# Altium project sla2216.PrjPcb
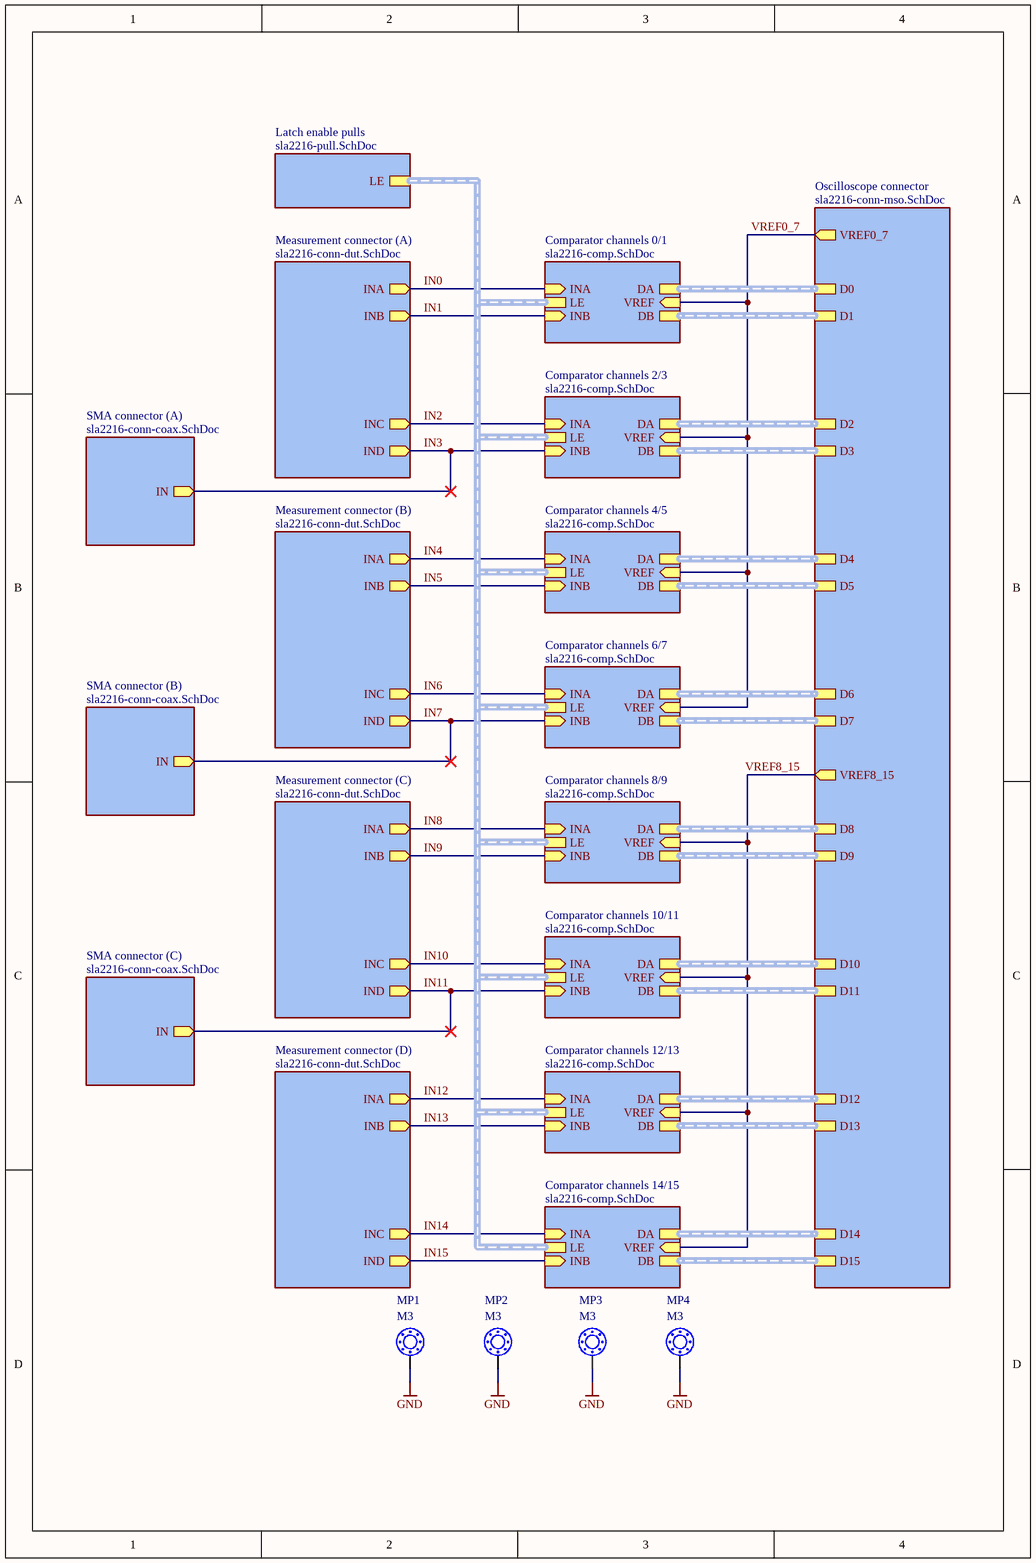
[diagram p0: sla2216.SchDoc]
6 sheets, 249 parts. Net scope: hierarchical (ports join the sheet entries above them; power ports are global).
Board file: sla2216.PcbDoc
Sheets:
  sla2216.SchDoc
    Oscilloscope connector = sla2216-conn-mso.SchDoc
    Comparator channels 0/1 = sla2216-comp.SchDoc
    Comparator channels 2/3 = sla2216-comp.SchDoc
    Comparator channels 4/5 = sla2216-comp.SchDoc
    Comparator channels 6/7 = sla2216-comp.SchDoc
    Comparator channels 8/9 = sla2216-comp.SchDoc
    Comparator channels 10/11 = sla2216-comp.SchDoc
    Comparator channels 12/13 = sla2216-comp.SchDoc
    Comparator channels 14/15 = sla2216-comp.SchDoc
    Measurement connector (A) = sla2216-conn-dut.SchDoc
    Measurement connector (B) = sla2216-conn-dut.SchDoc
    Measurement connector (C) = sla2216-conn-dut.SchDoc
    Measurement connector (D) = sla2216-conn-dut.SchDoc
    Latch enable pulls = sla2216-pull.SchDoc
    SMA connector (A) = sla2216-conn-coax.SchDoc
    SMA connector (B) = sla2216-conn-coax.SchDoc
    SMA connector (C) = sla2216-conn-coax.SchDoc

## Sheet sla2216.SchDoc
size A4 portrait; DocumentNumber: 1; SheetNumber: 1; SheetTotal: 6

### Parts
MP1  M3  [MP M3]  (no BOM)
MP2  M3  [MP M3]  (no BOM)
MP3  M3  [MP M3]  (no BOM)
MP4  M3  [MP M3]  (no BOM)

### Sub-sheets
Comparator channels 0/1 = sla2216-comp.SchDoc: DB (harness RSPECL), DA (harness RSPECL), INA (in), INB (in), VREF (in), LE (harness RSPECL)
Comparator channels 2/3 = sla2216-comp.SchDoc: DB (harness RSPECL), DA (harness RSPECL), INA (in), INB (in), VREF (in), LE (harness RSPECL)
Comparator channels 4/5 = sla2216-comp.SchDoc: DB (harness RSPECL), DA (harness RSPECL), INA (in), INB (in), VREF (in), LE (harness RSPECL)
Comparator channels 6/7 = sla2216-comp.SchDoc: DB (harness RSPECL), DA (harness RSPECL), INA (in), INB (in), VREF (in), LE (harness RSPECL)
Comparator channels 8/9 = sla2216-comp.SchDoc: DB (harness RSPECL), DA (harness RSPECL), INA (in), INB (in), VREF (in), LE (harness RSPECL)
Comparator channels 10/11 = sla2216-comp.SchDoc: DB (harness RSPECL), DA (harness RSPECL), INA (in), INB (in), VREF (in), LE (harness RSPECL)
Comparator channels 12/13 = sla2216-comp.SchDoc: DB (harness RSPECL), DA (harness RSPECL), INA (in), INB (in), VREF (in), LE (harness RSPECL)
Comparator channels 14/15 = sla2216-comp.SchDoc: DB (harness RSPECL), DA (harness RSPECL), INA (in), INB (in), VREF (in), LE (harness RSPECL)
Latch enable pulls = sla2216-pull.SchDoc: LE (harness RSPECL)
Measurement connector (A) = sla2216-conn-dut.SchDoc: INA (out), INB (out), INC (out), IND (out)
Measurement connector (B) = sla2216-conn-dut.SchDoc: INA (out), INB (out), INC (out), IND (out)
Measurement connector (C) = sla2216-conn-dut.SchDoc: INA (out), INB (out), INC (out), IND (out)
Measurement connector (D) = sla2216-conn-dut.SchDoc: INA (out), INB (out), INC (out), IND (out)
Oscilloscope connector = sla2216-conn-mso.SchDoc: D0 (harness RSPECL), D1 (harness RSPECL), D2 (harness RSPECL), D3 (harness RSPECL), VREF0_7 (out), D5 (harness RSPECL), D4 (harness RSPECL), D7 (harness RSPECL), D6 (harness RSPECL), VREF8_15 (out), D8 (harness RSPECL), D9 (harness RSPECL), D11 (harness RSPECL), D10 (harness RSPECL), D12 (harness RSPECL), D13 (harness RSPECL), D14 (harness RSPECL), D15 (harness RSPECL)
SMA connector (A) = sla2216-conn-coax.SchDoc: IN (out)
SMA connector (B) = sla2216-conn-coax.SchDoc: IN (out)
SMA connector (C) = sla2216-conn-coax.SchDoc: IN (out)

### Nets
GND: MP1.MP MP2.MP MP3.MP MP4.MP
IN0: sheet Comparator channels 0/1/INA, sheet Measurement connector (A)/INA
IN1: sheet Comparator channels 0/1/INB, sheet Measurement connector (A)/INB
IN2: sheet Comparator channels 2/3/INA, sheet Measurement connector (A)/INC
IN3: sheet Comparator channels 2/3/INB, sheet Measurement connector (A)/IND, sheet SMA connector (A)/IN
IN4: sheet Comparator channels 4/5/INA, sheet Measurement connector (B)/INA
IN5: sheet Comparator channels 4/5/INB, sheet Measurement connector (B)/INB
IN6: sheet Comparator channels 6/7/INA, sheet Measurement connector (B)/INC
IN7: sheet Comparator channels 6/7/INB, sheet Measurement connector (B)/IND, sheet SMA connector (B)/IN
IN8: sheet Comparator channels 8/9/INA, sheet Measurement connector (C)/INA
IN9: sheet Comparator channels 8/9/INB, sheet Measurement connector (C)/INB
IN10: sheet Comparator channels 10/11/INA, sheet Measurement connector (C)/INC
IN11: sheet Comparator channels 10/11/INB, sheet Measurement connector (C)/IND, sheet SMA connector (C)/IN
IN12: sheet Comparator channels 12/13/INA, sheet Measurement connector (D)/INA
IN13: sheet Comparator channels 12/13/INB, sheet Measurement connector (D)/INB
IN14: sheet Comparator channels 14/15/INA, sheet Measurement connector (D)/INC
IN15: sheet Comparator channels 14/15/INB, sheet Measurement connector (D)/IND
VREF0_7: sheet Oscilloscope connector/VREF0_7, sheet Comparator channels 0/1/VREF, sheet Comparator channels 2/3/VREF, sheet Comparator channels 4/5/VREF, sheet Comparator channels 6/7/VREF
VREF8_15: sheet Oscilloscope connector/VREF8_15, sheet Comparator channels 8/9/VREF, sheet Comparator channels 10/11/VREF, sheet Comparator channels 12/13/VREF, sheet Comparator channels 14/15/VREF

### Buses and harness runs
harness sheet Comparator channels 0/1/DA = sheet Oscilloscope connector/D0
harness sheet Comparator channels 0/1/DB = sheet Oscilloscope connector/D1
harness sheet Comparator channels 0/1/LE = sheet Comparator channels 2/3/LE = sheet Comparator channels 4/5/LE = sheet Comparator channels 6/7/LE = sheet Comparator channels 8/9/LE = sheet Comparator channels 10/11/LE = sheet Comparator channels 12/13/LE = sheet Comparator channels 14/15/LE = sheet Latch enable pulls/LE
harness sheet Comparator channels 2/3/DA = sheet Oscilloscope connector/D2
harness sheet Comparator channels 2/3/DB = sheet Oscilloscope connector/D3
harness sheet Comparator channels 4/5/DA = sheet Oscilloscope connector/D4
harness sheet Comparator channels 4/5/DB = sheet Oscilloscope connector/D5
harness sheet Comparator channels 6/7/DA = sheet Oscilloscope connector/D6
harness sheet Comparator channels 6/7/DB = sheet Oscilloscope connector/D7
harness sheet Comparator channels 8/9/DA = sheet Oscilloscope connector/D8
harness sheet Comparator channels 8/9/DB = sheet Oscilloscope connector/D9
harness sheet Comparator channels 10/11/DA = sheet Oscilloscope connector/D10
harness sheet Comparator channels 10/11/DB = sheet Oscilloscope connector/D11
harness sheet Comparator channels 12/13/DA = sheet Oscilloscope connector/D12
harness sheet Comparator channels 12/13/DB = sheet Oscilloscope connector/D13
harness sheet Comparator channels 14/15/DA = sheet Oscilloscope connector/D14
harness sheet Comparator channels 14/15/DB = sheet Oscilloscope connector/D15

### Library data of the parts
MP1-MP4 = Mountpoint: PCB mountpoint

## Sheet sla2216-conn-mso.SchDoc
size A4; DocumentNumber: 3; SheetNumber: 3; SheetTotal: 6
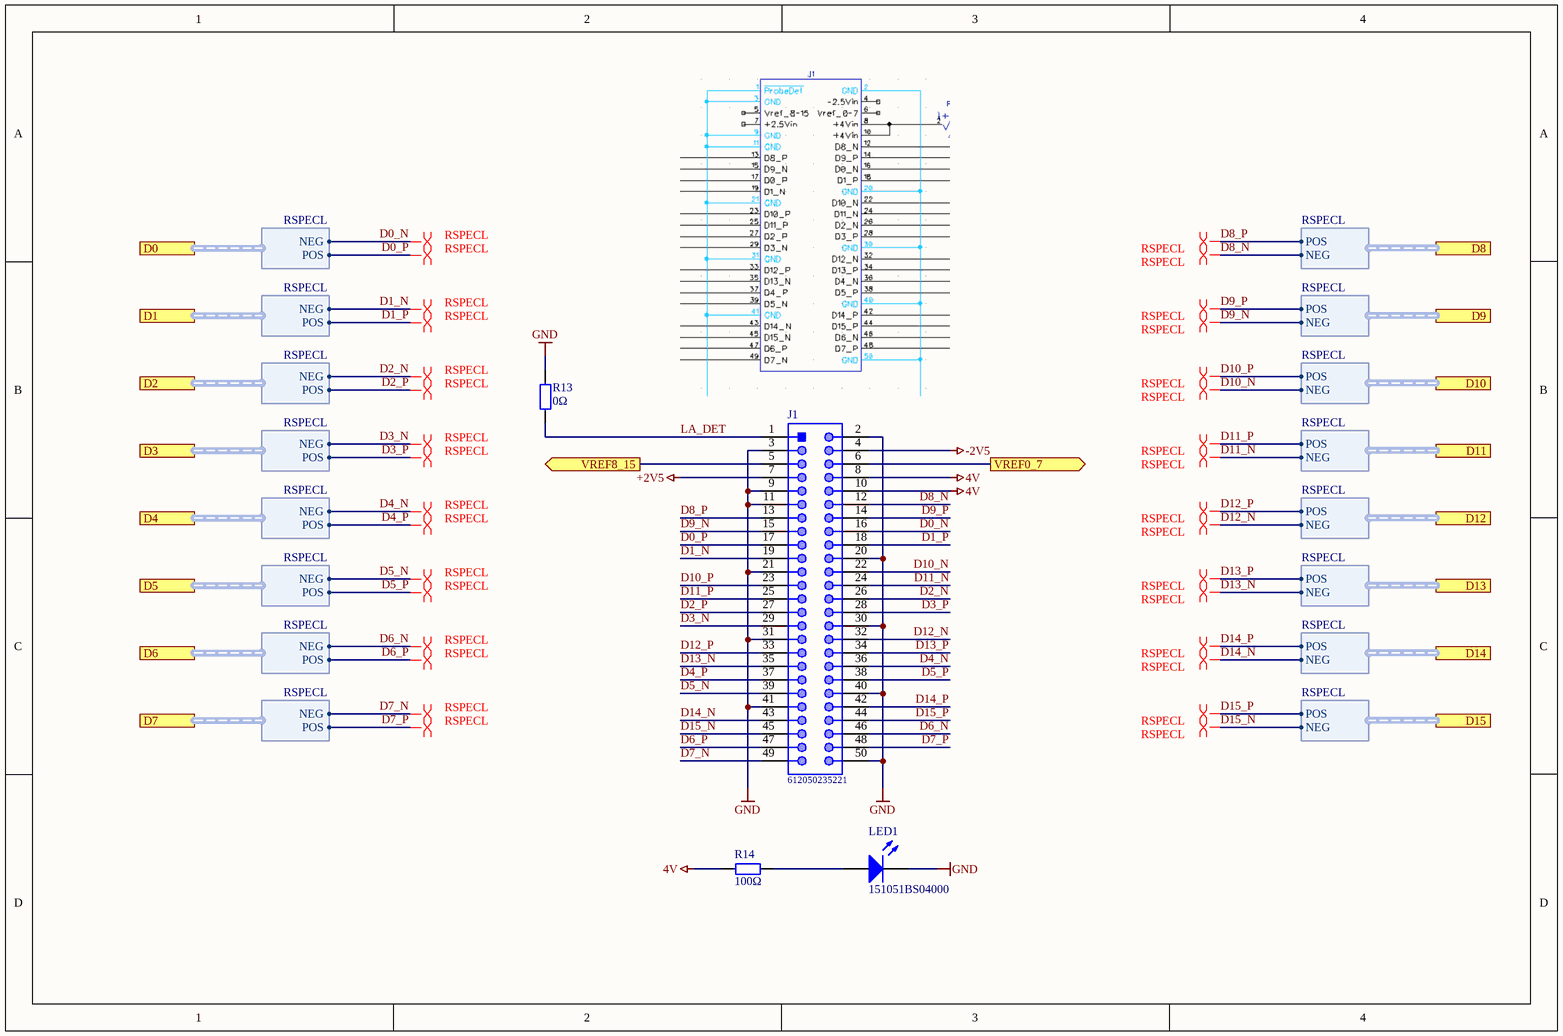
[diagram p1: sla2216-conn-mso.SchDoc]

### Parts
J1  612050235221  [612050235221]
LED1  151051BS04000  [Type 5mm]
R13  Resistance: 0Ω  [RES 0603/1608]
R14  Resistance: 100Ω  [RES 0603/1608]

### Ports
D0 (harness RSPECL), D1 (harness RSPECL), D2 (harness RSPECL), D3 (harness RSPECL), D4 (harness RSPECL), D5 (harness RSPECL), D6 (harness RSPECL), D7 (harness RSPECL), D8 (harness RSPECL), D9 (harness RSPECL), D10 (harness RSPECL), D11 (harness RSPECL), D12 (harness RSPECL), D13 (harness RSPECL), D14 (harness RSPECL), D15 (harness RSPECL), VREF0_7 (out), VREF8_15 (out)

### Harnesses
RSPECL: POS, NEG

### Nets
4V: J1.8 J1.10 R14.2
+2V5: J1.7
-2V5: J1.4
GND: J1.2 J1.3 J1.9 J1.11 J1.20 J1.21 J1.30 J1.31 J1.40 J1.41 J1.50 LED1.1(K) R13.1
D0_N: J1.16 ; port D0.NEG
D0_P: J1.17 ; port D0.POS
D1_N: J1.19 ; port D1.NEG
D1_P: J1.18 ; port D1.POS
D2_N: J1.26 ; port D2.NEG
D2_P: J1.27 ; port D2.POS
D3_N: J1.29 ; port D3.NEG
D3_P: J1.28 ; port D3.POS
D4_N: J1.36 ; port D4.NEG
D4_P: J1.37 ; port D4.POS
D5_N: J1.39 ; port D5.NEG
D5_P: J1.38 ; port D5.POS
D6_N: J1.46 ; port D6.NEG
D6_P: J1.47 ; port D6.POS
D7_N: J1.49 ; port D7.NEG
D7_P: J1.48 ; port D7.POS
D8_N: J1.12 ; port D8.NEG
D8_P: J1.13 ; port D8.POS
D9_N: J1.15 ; port D9.NEG
D9_P: J1.14 ; port D9.POS
D10_N: J1.22 ; port D10.NEG
D10_P: J1.23 ; port D10.POS
D11_N: J1.24 ; port D11.NEG
D11_P: J1.25 ; port D11.POS
D12_N: J1.32 ; port D12.NEG
D12_P: J1.33 ; port D12.POS
D13_N: J1.35 ; port D13.NEG
D13_P: J1.34 ; port D13.POS
D14_N: J1.43 ; port D14.NEG
D14_P: J1.42 ; port D14.POS
D15_N: J1.45 ; port D15.NEG
D15_P: J1.44 ; port D15.POS
LA_DET: J1.1 R13.2
VREF0_7: J1.6 ; port VREF0_7
VREF8_15: J1.5 ; port VREF8_15
NetLED1_2: LED1.2(A) R14.1

### Layout directives
differential pair; differential pair class RSPECL: D0_N, D0_P, D1_N, D1_P, D2_N, D2_P, D3_N, D3_P, D4_N, D4_P, D5_N, D5_P, D6_N, D6_P, D7_N, D7_P, D8_N, D8_P, D9_N, D9_P, D10_N, D10_P, D11_N, D11_P, D12_N, D12_P, D13_N, D13_P, D14_N, D14_P, D15_N, D15_P

### Library data of the parts
J1 = CMP-1502-00050-1: Male Box Header WR-BHD, THT, Angled, pitch 2.54 mm, 50 pins; Manufacturer: Wurth Elektronik; Withstanding Voltage: 500VAC; Pin Number: 50; Pitch: 2.54mm; Contact Resistance: 20mOhm; Working Voltage: 250VAC; Published Date: August2018; Publisher: WurthElektronik; Package Reference: 612050235221; Mounting Technology: THT; Part Number: 612050235221; Manufacturer URL: http://www.we-online.de; Packaging: Tray; Operating Temperature: -40to125degC; Orientation: Angled; Datasheet URL: https://katalog.we-online.de/em/datasheet/6120xx235221.pdf; Gender: Male
LED1 = CMP-1488-00009-1: THT LED round mono-color color lens, WL-TMRW, Blue; Manufacturer: Wuerth Elektronik; PackageReference: Type 5mm; ComponentLink2Description: Datasheet; ComponentLink1Description: Manufacturer URL; Emitting color: Blue; ComponentLink1URL: http://www.we-online.com; PartNumber: 151051BS04000; ComponentLink2URL: http://katalog.we-online.de/pbs/datasheet/7448042001.pdfhttp://katalog.we-online.de/pbs/datasheet/7448042001.pdfhttp://katalog.we-online.de/pbs/datasheet/7448042001.pdfhttp://katalog.we-online.de/pbs/datasheet/151051BS04000.pdf
R13 = Resistor: BOMref: RES_0Ω_5%_50V_0603; Tolerance: 5%; Voltage Rating: 50V; Package: 0603
R14 = Resistor: BOMref: RES_100Ω_5%_50V_0603; Tolerance: 5%; Voltage Rating: 50V; Package: 0603

## Sheet sla2216-comp.SchDoc
size A4; DocumentNumber: 2; SheetNumber: 2; SheetTotal: 6
Used 8 times, as channels Comparator channels 0/1, Comparator channels 2/3, Comparator channels 4/5, Comparator channels 6/7, Comparator channels 8/9, Comparator channels 10/11, Comparator channels 12/13, Comparator channels 14/15. Parts and nets are listed once, with the designators drawn on the sheet.
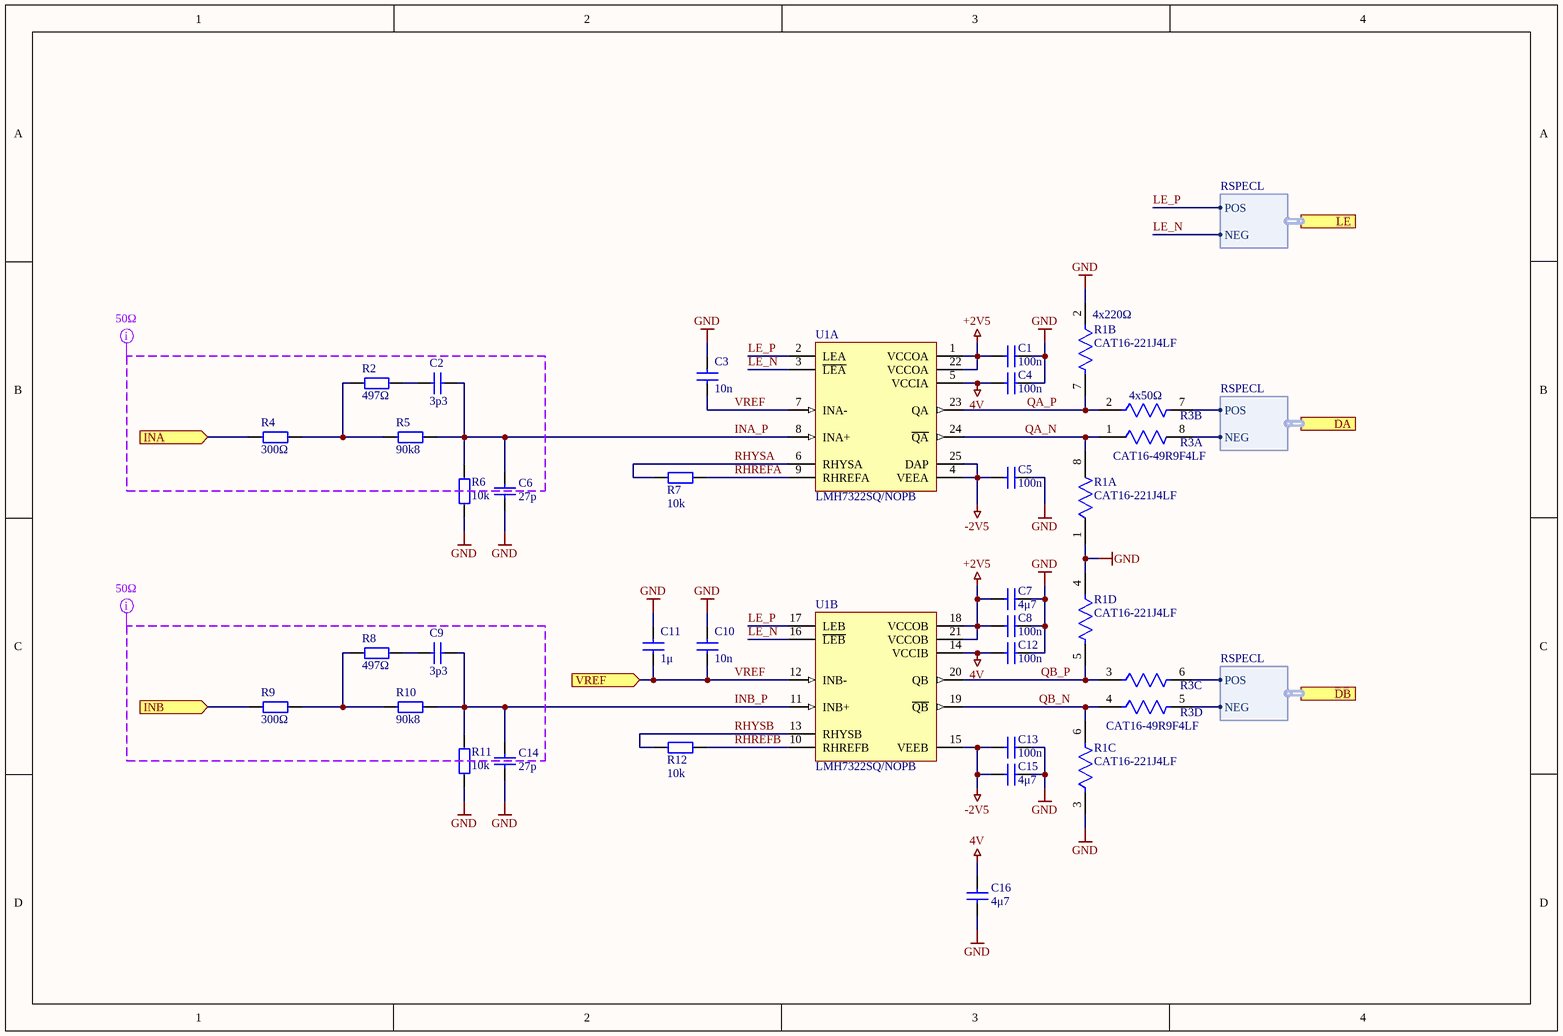
[diagram p2: sla2216-comp.SchDoc]

### Parts
C1  Capacitance: 100n  [CAP 0402/1005]
C2  Capacitance: 3p3  [CAP 0402/1005]
C3  Capacitance: 10n  [CAP 0402/1005]
C4  Capacitance: 100n  [CAP 0402/1005]
C5  Capacitance: 100n  [CAP 0402/1005]
C6  Capacitance: 27p  [CAP 0402/1005]
C7  Capacitance: 4μ7  [CAP 0603/1608]
C8  Capacitance: 100n  [CAP 0402/1005]
C9  Capacitance: 3p3  [CAP 0402/1005]
C10  Capacitance: 10n  [CAP 0402/1005]
C11  Capacitance: 1μ  [CAP 0603/1608]
C12  Capacitance: 100n  [CAP 0402/1005]
C13  Capacitance: 100n  [CAP 0402/1005]
C14  Capacitance: 27p  [CAP 0402/1005]
C15  Capacitance: 4μ7  [CAP 0603/1608]
C16  Capacitance: 4μ7  [CAP 0603/1608]
R1  CAT16-221J4LF  [FP-CAT16-F4-MFG]  (parts A,B,C,D of 4)
R2  Resistance: 497Ω  [RES 0402/1005]
R3  CAT16-49R9F4LF  [FP-CAT16-F4-MFG]  (parts A,B,C,D of 4)
R4  Resistance: 300Ω  [RES 0805/2012]
R5  Resistance: 90k8  [RES 0402/1005]
R6  Resistance: 10k  [RES 0402/1005]
R7  Resistance: 10k  [RES 0402/1005]
R8  Resistance: 497Ω  [RES 0402/1005]
R9  Resistance: 300Ω  [RES 0805/2012]
R10  Resistance: 90k8  [RES 0402/1005]
R11  Resistance: 10k  [RES 0402/1005]
R12  Resistance: 10k  [RES 0402/1005]
U1  LMH7322SQ/NOPB  [RTW0024A_V]  (parts A,B of 2)

### Ports
DA (harness RSPECL), DB (harness RSPECL), INA (in), INB (in), LE (harness RSPECL), VREF (in)

### Harnesses
RSPECL: POS, NEG

### Nets
4V: C4.2 C12.2 C16.2 U1.5(VCCIA) U1.14(VCCIB)
+2V5: C1.2 C7.1 C8.2 U1.1(VCCOA) U1.18(VCCOB) U1.21(VCCOB) U1.22(VCCOA)
-2V5: C5.2 C13.2 C15.1 U1.4(VEEA) U1.15(VEEB) U1.25(DAP)
GND: C1.1 C3.1 C4.1 C5.1 C6.2 C7.2 C8.1 C10.1 C11.2 C12.1 C13.1 C14.2 C15.2 C16.1 R1.1 R1.2 R1.3 R1.4 R6.2 R11.2
INA: R4.1 ; port INA
INA_P: C2.2 C6.1 R5.2 R6.1 U1.8(INA+)
INB: R9.1 ; port INB
INB_P: C9.2 C14.1 R10.2 R11.1 U1.11(INB+)
LE_N: U1.3(~{LEA}) U1.16(~{LEB}) ; port LE.NEG
LE_P: U1.2(LEA) U1.17(LEB) ; port LE.POS
QA_N: R1.8 R3.1 U1.24(~{QA})
QA_P: R1.7 R3.2 U1.23(QA)
QB_N: R1.6 R3.4 U1.19(~{QB})
QB_P: R1.5 R3.3 U1.20(QB)
RHREFA: R7.1 U1.9(RHREFA)
RHREFB: R12.1 U1.10(RHREFB)
RHYSA: R7.2 U1.6(RHYSA)
RHYSB: R12.2 U1.13(RHYSB)
VREF: C3.2 C10.2 C11.1 U1.7(INA-) U1.12(INB-) ; port VREF
NetC2_1: C2.1 R2.2
NetC9_1: C9.1 R8.2
NetR2_1: R2.1 R4.2 R5.1
NetR3_5: R3.5 ; port DB.NEG
NetR3_6: R3.6 ; port DB.POS
NetR3_7: R3.7 ; port DA.POS
NetR3_8: R3.8 ; port DA.NEG
NetR8_1: R8.1 R9.2 R10.1

### Channels
Comparator channels 0/1: designators end in A; ports INA=IN0 INB=IN1 VREF=VREF0_7
Comparator channels 2/3: designators end in B; ports INA=IN2 INB=IN3 VREF=VREF0_7
Comparator channels 4/5: designators end in C; ports INA=IN4 INB=IN5 VREF=VREF0_7
Comparator channels 6/7: designators end in D; ports INA=IN6 INB=IN7 VREF=VREF0_7
Comparator channels 8/9: designators end in E; ports INA=IN8 INB=IN9 VREF=VREF8_15
Comparator channels 10/11: designators end in F; ports INA=IN10 INB=IN11 VREF=VREF8_15
Comparator channels 12/13: designators end in G; ports INA=IN12 INB=IN13 VREF=VREF8_15
Comparator channels 14/15: designators end in H; ports INA=IN14 INB=IN15 VREF=VREF8_15

### Layout directives
net class 50_OHM: (no net found under the mark)

### Notes on the sheet
- (near R1) 4x220Ω
- (near R3) 4x50Ω

### Library data of the parts
C1 C4 C5 C8 C12 C13 = Capacitor: Ceramic Capacitor; Rated Voltage: 10V; BOMref: CAPC_100n_10%_10V_X7R_0402; Dielectric: X7R; Tolerance: 10%; Package: 0402
C2 C9 = Capacitor: Ceramic Capacitor; Rated Voltage: 16V; BOMref: CAPC_3p3_10%_16V_C0G_0402; Dielectric: C0G; Tolerance: 10%; Package: 0402
C3 C10 = Capacitor: Ceramic Capacitor; Rated Voltage: 10V; BOMref: CAPC_10n_10%_10V_X7R_0402; Dielectric: X7R; Tolerance: 10%; Package: 0402
C6 C14 = Capacitor: Ceramic Capacitor; Rated Voltage: 16V; BOMref: CAPC_27p_10%_16V_C0G_0402; Dielectric: C0G; Tolerance: 10%; Package: 0402
C7 C15 C16 = Capacitor: Ceramic Capacitor; Rated Voltage: 6V3; BOMref: CAPC_4μ7_10%_6V3_X7R_0603; Dielectric: X7R; Tolerance: 10%; Package: 0603
C11 = Capacitor: Ceramic Capacitor; Rated Voltage: 6V3; BOMref: CAPC_1μ_10%_6V3_X7R_0603; Dielectric: X7R; Tolerance: 10%; Package: 0603
R1 = CMP-07230-000005-1: RES ARRAY 4 RES 220 OHM 1206; Resistance: 49.9R; Temperature Coefficient: 200ppm/°C; Voltage Rating: 50V; Power Per Element: 62.5mW; Circuit Type: Isolated; Number of Resistors: 4; Power Rating: 248mW; Tolerance: 1%; Lead Pitch: 0.8mm; Max Operating Temperature: 125°C; Width: 0.063inch; Voltage Rating (DC): 50V; Number of Pins: 8; Depth: 1.6mm; REACH SVHC: No SVHC; Length: 3.2mm; Terminal Pitch: 0.8mm; Case Code (Metric): 3216; Radiation Hardening: No; Min Operating Temperature: -55°C; Packaging: Tape and Reel; Number of Terminals: 8; Military Standard: Not; Height: 0.024inch; Mount: Surface Mount; Termination: Concave; Package Quantity: 1; Number of Elements: 4; Case/Package: 1206; Case Code (Imperial): 1206
R2 R8 = Resistor: BOMref: RES_497Ω_5%_50V_0402; Tolerance: 5%; Voltage Rating: 50V; Package: 0402
R3 = CMP-07230-000005-1: RES ARRAY 4 RES 49.9 OHM 1206; Resistance: 49.9R; Temperature Coefficient: 200ppm/°C; Voltage Rating: 50V; Power Per Element: 62.5mW; Circuit Type: Isolated; Number of Resistors: 4; Power Rating: 248mW; Tolerance: 1%; Lead Pitch: 0.8mm; Max Operating Temperature: 125°C; Width: 0.063inch; Voltage Rating (DC): 50V; Number of Pins: 8; Depth: 1.6mm; REACH SVHC: No SVHC; Length: 3.2mm; Terminal Pitch: 0.8mm; Case Code (Metric): 3216; Radiation Hardening: No; Min Operating Temperature: -55°C; Packaging: Tape and Reel; Number of Terminals: 8; Military Standard: Not; Height: 0.024inch; Mount: Surface Mount; Termination: Concave; Package Quantity: 1; Number of Elements: 4; Case/Package: 1206; Case Code (Imperial): 1206
R4 R9 = Resistor: BOMref: RES_300Ω_5%_50V_0805; Tolerance: 5%; Voltage Rating: 50V; Package: 0805
R5 R10 = Resistor: BOMref: RES_90k8_5%_50V_0402; Tolerance: 5%; Voltage Rating: 50V; Package: 0402
R6 R7 R11 R12 = Resistor: BOMref: RES_10k_5%_50V_0402; Tolerance: 5%; Voltage Rating: 50V; Package: 0402
U1 = CMP-0055-00284-3: Dual 700 ps High Speed Comparator with RSPECL Outputs, 24-pin LLP, Pb-Free; Manufacturer: Texas Instruments; CompType: Amplifiers; PackageTopMarking: NS*UZXYTT*L7322SQ; PowerWise: Y; ComponentLink1Description: Datasheet URL; ComponentLink1URL: http://www.ti.com/general/docs/lit/getliterature.tsp?genericPartNumber=LMH7322&fileType=pdf; Code_JEDEC: MO-220-WGGD-6; RoHS: Y; PinCount: 24; Package Reference: RTW0024A; PackageDescription: LLP, Plastic, Quad, 4 x 4 x 0.8mm Body, 24 Lead, 0.5mm Pitch, No Pullback

## Sheet sla2216-conn-dut.SchDoc
size A4; DocumentNumber: 4; SheetNumber: 4; SheetTotal: 6
Used 4 times, as channels Measurement connector (A), Measurement connector (B), Measurement connector (C), Measurement connector (D). Parts and nets are listed once, with the designators drawn on the sheet.
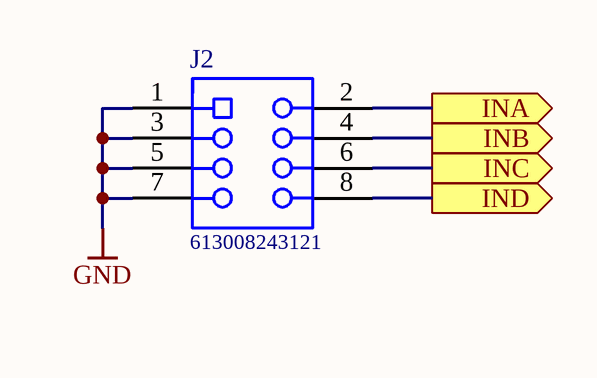
[diagram p3: sla2216-conn-dut.SchDoc]

### Parts
J2  613008243121  [613008243121]

### Ports
INA (out), INB (out), INC (out), IND (out)

### Nets
GND: J2.1 J2.3 J2.5 J2.7
INA: J2.2 ; port INA
INB: J2.4 ; port INB
INC: J2.6 ; port INC
IND: J2.8 ; port IND

### Channels
Measurement connector (A): designators end in A; ports INA=IN0 INB=IN1 INC=IN2 IND=IN3
Measurement connector (B): designators end in B; ports INA=IN4 INB=IN5 INC=IN6 IND=IN7
Measurement connector (C): designators end in C; ports INA=IN8 INB=IN9 INC=IN10 IND=IN11
Measurement connector (D): designators end in D; ports INA=IN12 INB=IN13 INC=IN14 IND=IN15

### Library data of the parts
J2 = CMP-1502-01417-1: THT Angled Socket Header WR-PHD, Pitch 2.54 mm, Dual Row, 8 pins; Manufacturer: Wurth Elektronik; Rated Current: 3A; Pitch: 2.54mm; Contact Resistance: 20mOhm; Gender: Female; Withstanding Voltage: 500VAC; Working Voltage: 250VAC; Pin Number: 8; Row Number: Dual; Operating Temperature: -40to125degC; Packaging: Tray; Manufacturer URL: http://www.we-online.de; Mounting Technology: THT; Package Reference: 613008243121; Orientation: Angled; Part Number: 613008243121; Publisher: WurthElektronik; Datasheet URL: https://katalog.we-online.de/em/datasheet/6130xx243121.pdf

## Sheet sla2216-pull.SchDoc
size A4; DocumentNumber: 6; SheetNumber: 6; SheetTotal: 6
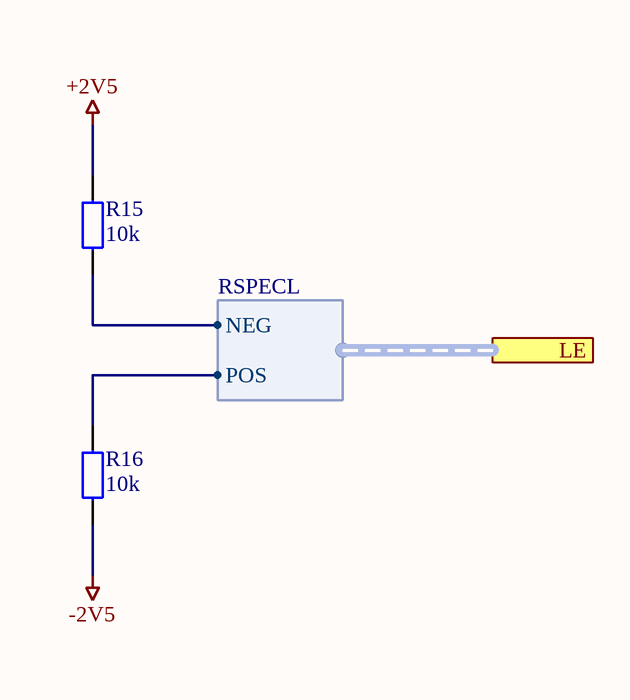
[diagram p4: sla2216-pull.SchDoc]

### Parts
R15  Resistance: 10k  [RES 0603/1608]
R16  Resistance: 10k  [RES 0603/1608]

### Ports
LE (harness RSPECL)

### Harnesses
RSPECL: POS, NEG

### Nets
+2V5: R15.1
-2V5: R16.1
LE_N: R15.2 ; port LE.NEG
LE_P: R16.2 ; port LE.POS

### Library data of the parts
R15 R16 = Resistor: BOMref: RES_10k_5%_50V_0603; Tolerance: 5%; Voltage Rating: 50V; Package: 0603

## Sheet sla2216-conn-coax.SchDoc
size A4; DocumentNumber: 5; SheetNumber: 5; SheetTotal: 6
Used 3 times, as channels SMA connector (A), SMA connector (B), SMA connector (C). Parts and nets are listed once, with the designators drawn on the sheet.
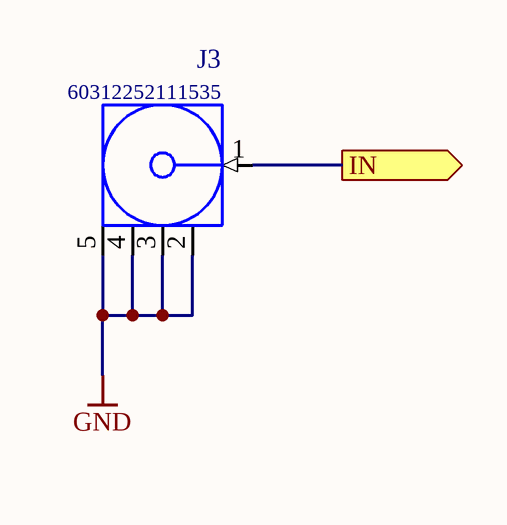
[diagram p5: sla2216-conn-coax.SchDoc]

### Parts
J3  60312252111535  [60312252111535]

### Ports
IN (out)

### Nets
GND: J3.2(GND) J3.3(GND) J3.4(GND) J3.5(GND)
IN: J3.1(Signal) ; port IN

### Channels
SMA connector (A): designators end in A; ports IN=IN3
SMA connector (B): designators end in B; ports IN=IN7
SMA connector (C): designators end in C; ports IN=IN11

### Library data of the parts
J3 = 60312252111535: WR-SMA Connector, PCB End Launch Jack, IP67, DC~6GHz, 50Ohm; Manufacturer: Wurth Elektronik; Connector Type: SMA; Orientation Type: Straight; Interface: MIL-STD-348; Center Contact Diameter: 0.51 WIDE x 0.25 THK; ComponentLink1Description: Manufacturer; ComponentLink1URL: http://www.we-online.de; ComponentLink2Description: Datasheet; ComponentLink2URL: https://www.we-online.com/catalog/datasheet/60312252111535.pdf; Manufacturer Part Number: 60312252111535; Published Date: November 2021; Operating Temperature: -65 to +165degC; Gender: Jack; Impedance: 50Ohm; Packaging: Tray; Frequency Range: DC~6GHz; Mounting Technology: End Launch

## Nets that join several sheets
4V: sla2216-conn-mso (J1.8 J1.10 R14.2), Comparator channels 0/1 (5 pins), Comparator channels 2/3 (5 pins), Comparator channels 4/5 (5 pins), Comparator channels 6/7 (5 pins), Comparator channels 8/9 (5 pins), Comparator channels 10/11 (5 pins), Comparator channels 12/13 (5 pins), Comparator channels 14/15 (5 pins)
+2V5: sla2216-conn-mso (J1.7), Comparator channels 0/1 (7 pins), Comparator channels 2/3 (7 pins), Comparator channels 4/5 (7 pins), Comparator channels 6/7 (7 pins), Comparator channels 8/9 (7 pins), Comparator channels 10/11 (7 pins), Comparator channels 12/13 (7 pins), Comparator channels 14/15 (7 pins), sla2216-pull (R15.1)
-2V5: sla2216-conn-mso (J1.4), Comparator channels 0/1 (6 pins), Comparator channels 2/3 (6 pins), Comparator channels 4/5 (6 pins), Comparator channels 6/7 (6 pins), Comparator channels 8/9 (6 pins), Comparator channels 10/11 (6 pins), Comparator channels 12/13 (6 pins), Comparator channels 14/15 (6 pins), sla2216-pull (R16.1)
GND: sla2216 (MP1.MP MP2.MP MP3.MP MP4.MP), sla2216-conn-mso (13 pins), Comparator channels 0/1 (20 pins), Comparator channels 2/3 (20 pins), Comparator channels 4/5 (20 pins), Comparator channels 6/7 (20 pins), Comparator channels 8/9 (20 pins), Comparator channels 10/11 (20 pins), Comparator channels 12/13 (20 pins), Comparator channels 14/15 (20 pins), Measurement connector (A) (J2A.1 J2A.3 J2A.5 J2A.7), Measurement connector (B) (J2B.1 J2B.3 J2B.5 J2B.7), Measurement connector (C) (J2C.1 J2C.3 J2C.5 J2C.7), Measurement connector (D) (J2D.1 J2D.3 J2D.5 J2D.7), SMA connector (A) (J3A.2 J3A.3 J3A.4 J3A.5), SMA connector (B) (J3B.2 J3B.3 J3B.4 J3B.5), SMA connector (C) (J3C.2 J3C.3 J3C.4 J3C.5)
D0_N: sla2216-conn-mso (J1.16), Comparator channels 0/1 (R3A.8)
D0_P: sla2216-conn-mso (J1.17), Comparator channels 0/1 (R3A.7)
D1_N: sla2216-conn-mso (J1.19), Comparator channels 0/1 (R3A.5)
D1_P: sla2216-conn-mso (J1.18), Comparator channels 0/1 (R3A.6)
D2_N: sla2216-conn-mso (J1.26), Comparator channels 2/3 (R3B.8)
D2_P: sla2216-conn-mso (J1.27), Comparator channels 2/3 (R3B.7)
D3_N: sla2216-conn-mso (J1.29), Comparator channels 2/3 (R3B.5)
D3_P: sla2216-conn-mso (J1.28), Comparator channels 2/3 (R3B.6)
D4_N: sla2216-conn-mso (J1.36), Comparator channels 4/5 (R3C.8)
D4_P: sla2216-conn-mso (J1.37), Comparator channels 4/5 (R3C.7)
D5_N: sla2216-conn-mso (J1.39), Comparator channels 4/5 (R3C.5)
D5_P: sla2216-conn-mso (J1.38), Comparator channels 4/5 (R3C.6)
D6_N: sla2216-conn-mso (J1.46), Comparator channels 6/7 (R3D.8)
D6_P: sla2216-conn-mso (J1.47), Comparator channels 6/7 (R3D.7)
D7_N: sla2216-conn-mso (J1.49), Comparator channels 6/7 (R3D.5)
D7_P: sla2216-conn-mso (J1.48), Comparator channels 6/7 (R3D.6)
D8_N: sla2216-conn-mso (J1.12), Comparator channels 8/9 (R3E.8)
D8_P: sla2216-conn-mso (J1.13), Comparator channels 8/9 (R3E.7)
D9_N: sla2216-conn-mso (J1.15), Comparator channels 8/9 (R3E.5)
D9_P: sla2216-conn-mso (J1.14), Comparator channels 8/9 (R3E.6)
D10_N: sla2216-conn-mso (J1.22), Comparator channels 10/11 (R3F.8)
D10_P: sla2216-conn-mso (J1.23), Comparator channels 10/11 (R3F.7)
D11_N: sla2216-conn-mso (J1.24), Comparator channels 10/11 (R3F.5)
D11_P: sla2216-conn-mso (J1.25), Comparator channels 10/11 (R3F.6)
D12_N: sla2216-conn-mso (J1.32), Comparator channels 12/13 (R3G.8)
D12_P: sla2216-conn-mso (J1.33), Comparator channels 12/13 (R3G.7)
D13_N: sla2216-conn-mso (J1.35), Comparator channels 12/13 (R3G.5)
D13_P: sla2216-conn-mso (J1.34), Comparator channels 12/13 (R3G.6)
D14_N: sla2216-conn-mso (J1.43), Comparator channels 14/15 (R3H.8)
D14_P: sla2216-conn-mso (J1.42), Comparator channels 14/15 (R3H.7)
D15_N: sla2216-conn-mso (J1.45), Comparator channels 14/15 (R3H.5)
D15_P: sla2216-conn-mso (J1.44), Comparator channels 14/15 (R3H.6)
IN0: Comparator channels 0/1 (R4A.1), Measurement connector (A) (J2A.2)
IN1: Comparator channels 0/1 (R9A.1), Measurement connector (A) (J2A.4)
IN2: Comparator channels 2/3 (R4B.1), Measurement connector (A) (J2A.6)
IN3: Comparator channels 2/3 (R9B.1), Measurement connector (A) (J2A.8), SMA connector (A) (J3A.1)
IN4: Comparator channels 4/5 (R4C.1), Measurement connector (B) (J2B.2)
IN5: Comparator channels 4/5 (R9C.1), Measurement connector (B) (J2B.4)
IN6: Comparator channels 6/7 (R4D.1), Measurement connector (B) (J2B.6)
IN7: Comparator channels 6/7 (R9D.1), Measurement connector (B) (J2B.8), SMA connector (B) (J3B.1)
IN8: Comparator channels 8/9 (R4E.1), Measurement connector (C) (J2C.2)
IN9: Comparator channels 8/9 (R9E.1), Measurement connector (C) (J2C.4)
IN10: Comparator channels 10/11 (R4F.1), Measurement connector (C) (J2C.6)
IN11: Comparator channels 10/11 (R9F.1), Measurement connector (C) (J2C.8), SMA connector (C) (J3C.1)
IN12: Comparator channels 12/13 (R4G.1), Measurement connector (D) (J2D.2)
IN13: Comparator channels 12/13 (R9G.1), Measurement connector (D) (J2D.4)
IN14: Comparator channels 14/15 (R4H.1), Measurement connector (D) (J2D.6)
IN15: Comparator channels 14/15 (R9H.1), Measurement connector (D) (J2D.8)
LE_N: Comparator channels 0/1 (U1A.3 U1A.16), Comparator channels 2/3 (U1B.3 U1B.16), Comparator channels 4/5 (U1C.3 U1C.16), Comparator channels 6/7 (U1D.3 U1D.16), Comparator channels 8/9 (U1E.3 U1E.16), Comparator channels 10/11 (U1F.3 U1F.16), Comparator channels 12/13 (U1G.3 U1G.16), Comparator channels 14/15 (U1H.3 U1H.16), sla2216-pull (R15.2)
LE_P: Comparator channels 0/1 (U1A.2 U1A.17), Comparator channels 2/3 (U1B.2 U1B.17), Comparator channels 4/5 (U1C.2 U1C.17), Comparator channels 6/7 (U1D.2 U1D.17), Comparator channels 8/9 (U1E.2 U1E.17), Comparator channels 10/11 (U1F.2 U1F.17), Comparator channels 12/13 (U1G.2 U1G.17), Comparator channels 14/15 (U1H.2 U1H.17), sla2216-pull (R16.2)
VREF0_7: sla2216-conn-mso (J1.6), Comparator channels 0/1 (5 pins), Comparator channels 2/3 (5 pins), Comparator channels 4/5 (5 pins), Comparator channels 6/7 (5 pins)
VREF8_15: sla2216-conn-mso (J1.5), Comparator channels 8/9 (5 pins), Comparator channels 10/11 (5 pins), Comparator channels 12/13 (5 pins), Comparator channels 14/15 (5 pins)